# EasyEDA schematic Board for rover motors_2021-02-24.json
TITLE: Rover motors system; REV: 1.0; Date: 2021-02-11; Sheet: 1/1; Drawn By: Vladislav Lozhkin; Company: DOSAAF
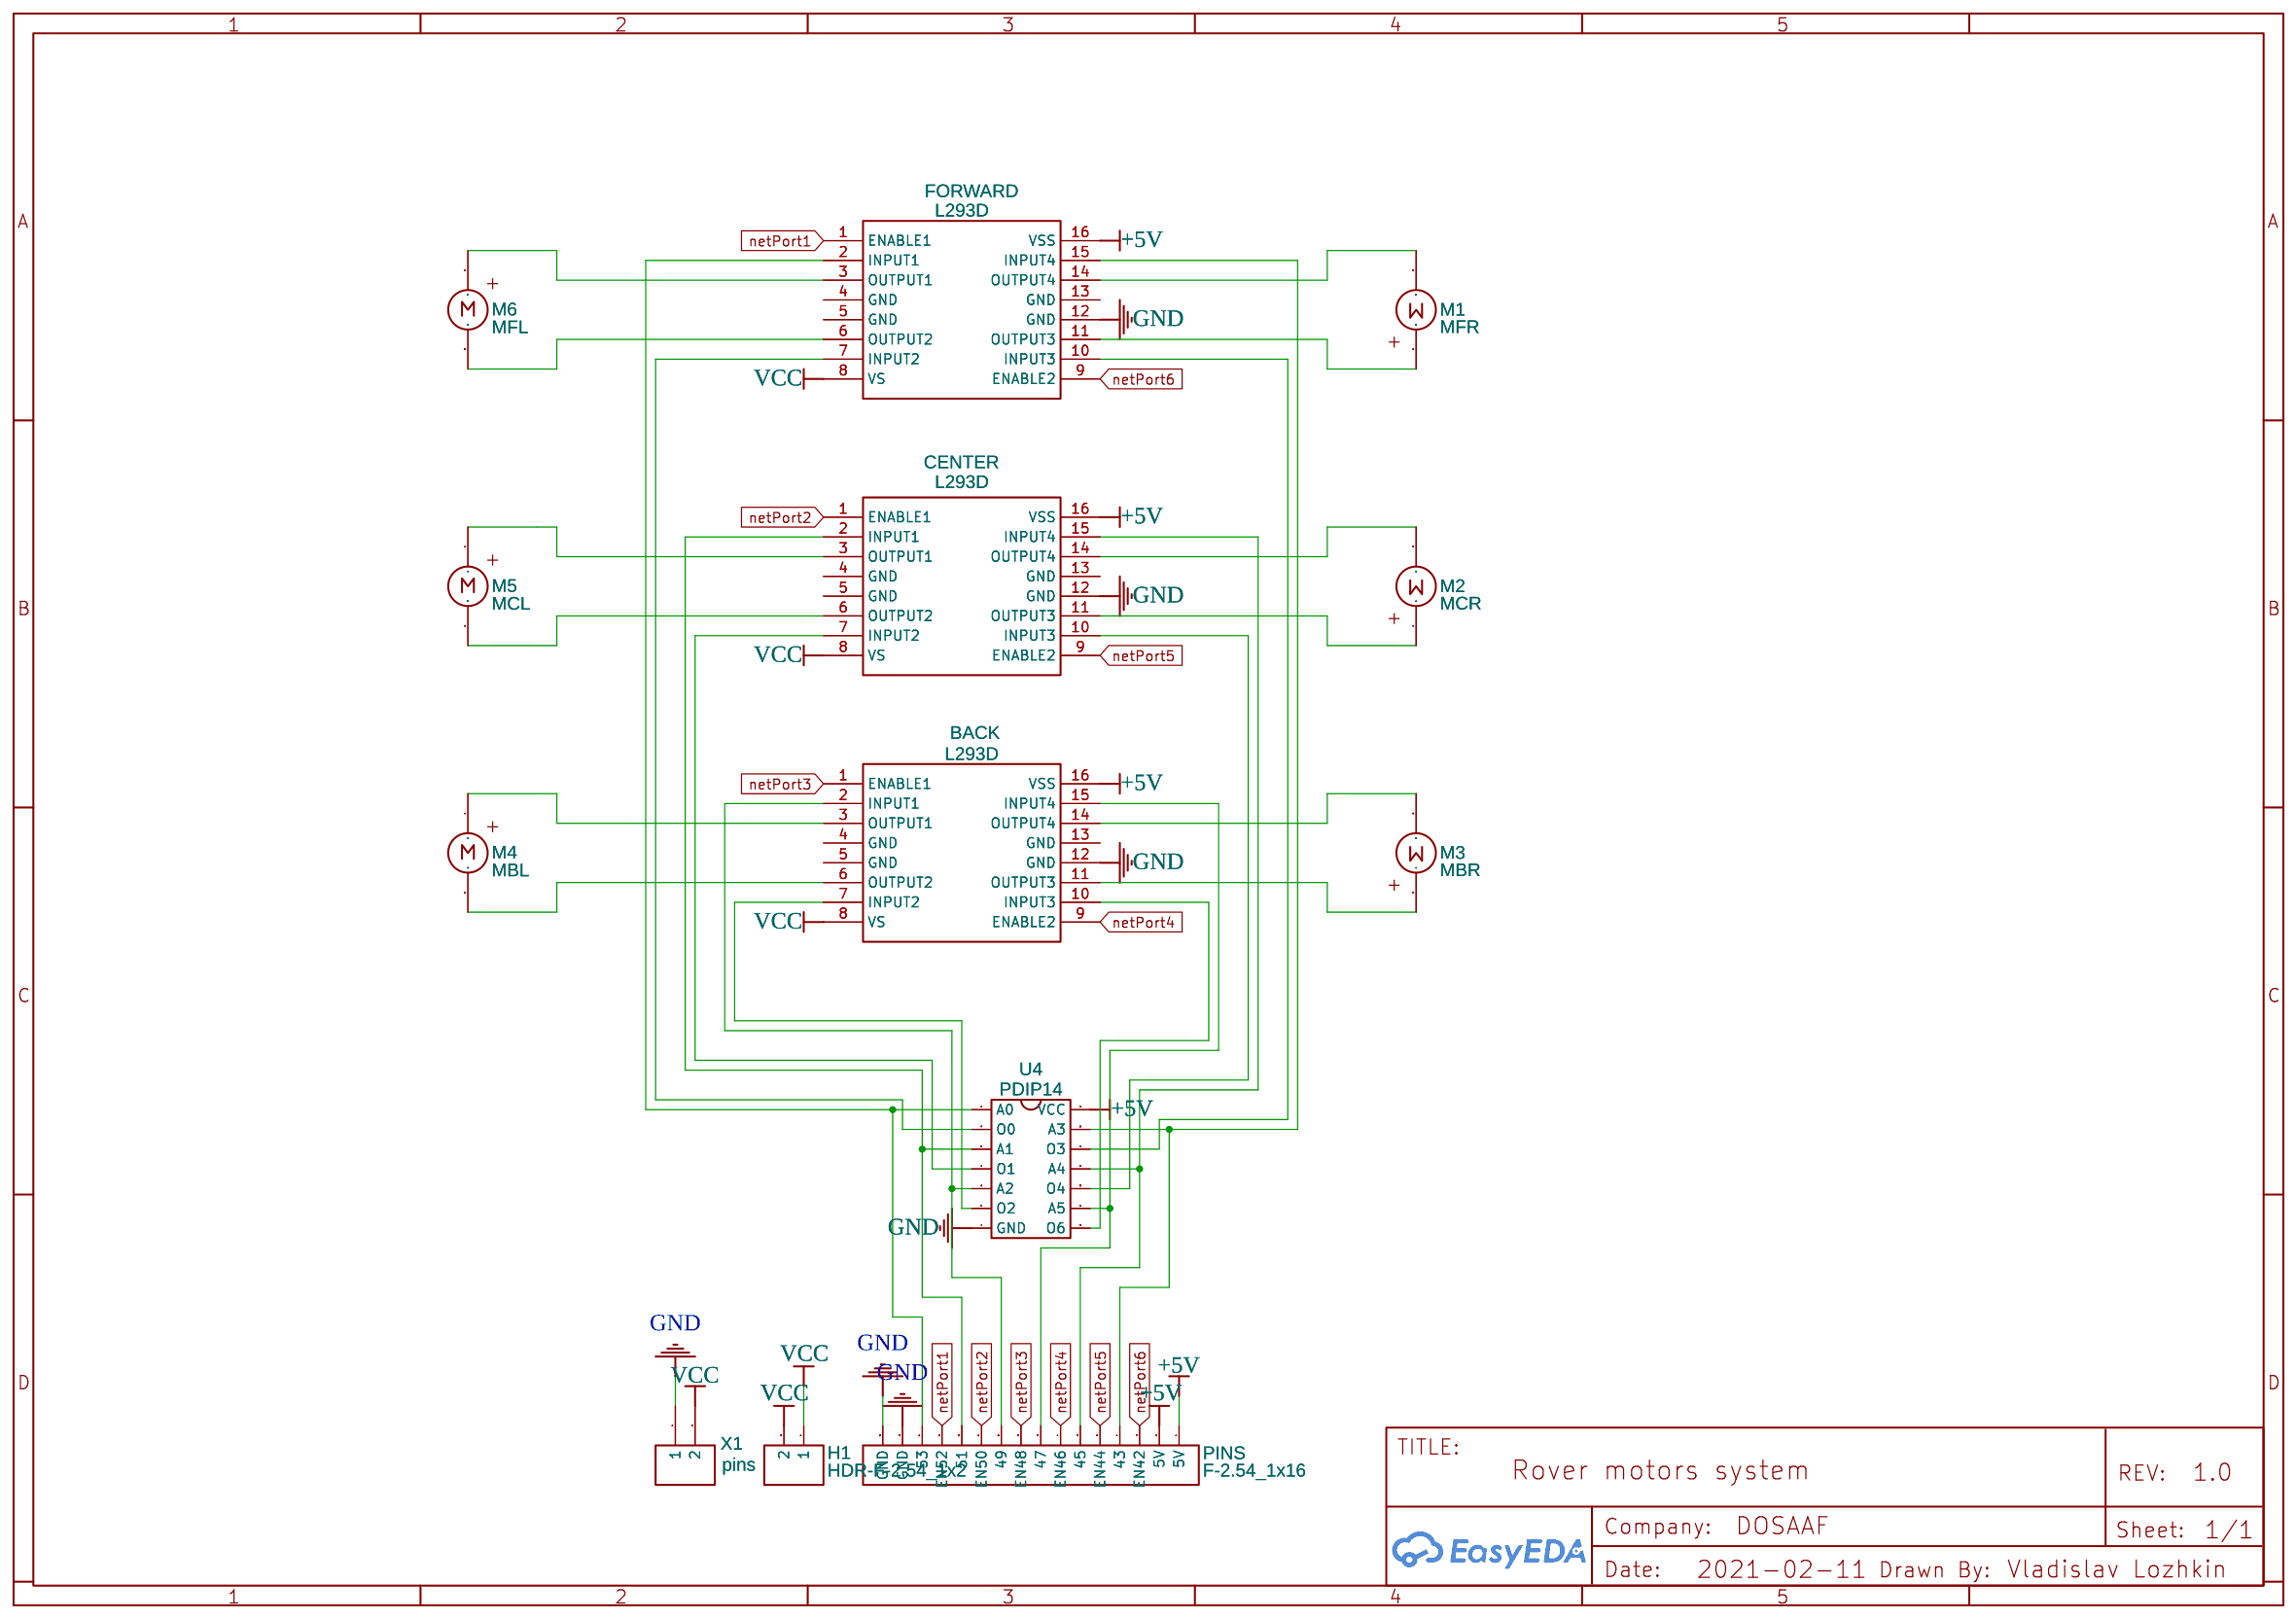
[diagram p0: schematic sheet]

## Parts
BACK  L293D  [DIP-16_L20.0-W6.4-P2.54-LS7.6-BL]
CENTER  L293D  [DIP-16_L20.0-W6.4-P2.54-LS7.6-BL]
FORWARD  L293D  [DIP-16_L20.0-W6.4-P2.54-LS7.6-BL]
H1  HDR-F-2.54_1x2  [HDR-F-2.54_1X2]
M1  MFR  [DIP-1X2P-2.54MM(5.08X5.08)]
M2  MCR  [DIP-1X2P-2.54MM(5.08X5.08)]
M3  MBR  [DIP-1X2P-2.54MM(5.08X5.08)]
M4  MBL  [DIP-1X2P-2.54MM(5.08X5.08)]
M5  MCL  [DIP-1X2P-2.54MM(5.08X5.08)]
M6  MFL  [DIP-1X2P-2.54MM(5.08X5.08)]
PINS  F-2.54_1x16  [HDR-F-2.54_1X16]
U4  PDIP14  [DIP14_TOMI_911]
X1  pins  [KLS2-301-5.00-02P///]

## Library data of the parts
BACK CENTER FORWARD = L293D: Contributor: pitreluc; Supplier: LCSC; Manufacturer: STMicroelectronics; image: //image.lceda.cn/szlcsc/C12340.jpg; Supplier Part: C12340
H1 = HDR-F-2.54_1x2: Supplier Part: C49661; Supplier: LCSC; Contributor: LCEDA_Lib
M1-M6 = MOTOR: Contributor: philip_productions_106
PINS = HDR-F-2.54_1x16: Supplier Part: C66987; Supplier: LCSC; Contributor: LCEDA_Lib
U4 = PDIP14: Contributor: Tomi_911
X1 = клеммник: Contributor: petrychaAA

## Nets
+5V: BACK.16(VSS) CENTER.16(VSS) FORWARD.16(VSS) PINS.1(5V) PINS.2(5V) U4.14(VCC)
GND: BACK.12(GND) CENTER.12(GND) FORWARD.12(GND) PINS.15(GND) PINS.16(GND) U4.7(GND) X1.1
VCC: BACK.8(VS) CENTER.8(VS) FORWARD.8(VS) H1.1 H1.2 X1.2
netPort1: FORWARD.1(ENABLE1) PINS.13(EN52)
netPort2: CENTER.1(ENABLE1) PINS.11(EN50)
netPort3: BACK.1(ENABLE1) PINS.9(EN48)
netPort4: BACK.9(ENABLE2) PINS.7(EN46)
netPort5: CENTER.9(ENABLE2) PINS.5(EN44)
netPort6: FORWARD.9(ENABLE2) PINS.3(EN42)
Net-(BACK-2): BACK.2(INPUT1) PINS.10(49) U4.5(A2)
Net-(BACK-3): BACK.3(OUTPUT1) M4.1
Net-(BACK-6): BACK.6(OUTPUT2) M4.2
Net-(BACK-7): BACK.7(INPUT2) U4.6(O2)
Net-(BACK-10): BACK.10(INPUT3) U4.8(O6)
Net-(BACK-11): BACK.11(OUTPUT3) M3.1
Net-(BACK-14): BACK.14(OUTPUT4) M3.2
Net-(BACK-15): BACK.15(INPUT4) PINS.8(47) U4.9(A5)
Net-(CENTER-2): CENTER.2(INPUT1) PINS.12(51) U4.3(A1)
Net-(CENTER-3): CENTER.3(OUTPUT1) M5.1
Net-(CENTER-6): CENTER.6(OUTPUT2) M5.2
Net-(CENTER-7): CENTER.7(INPUT2) U4.4(O1)
Net-(CENTER-10): CENTER.10(INPUT3) U4.10(O4)
Net-(CENTER-11): CENTER.11(OUTPUT3) M2.1
Net-(CENTER-14): CENTER.14(OUTPUT4) M2.2
Net-(CENTER-15): CENTER.15(INPUT4) PINS.6(45) U4.11(A4)
Net-(FORWARD-2): FORWARD.2(INPUT1) PINS.14(53) U4.1(A0)
Net-(FORWARD-3): FORWARD.3(OUTPUT1) M6.1
Net-(FORWARD-6): FORWARD.6(OUTPUT2) M6.2
Net-(FORWARD-7): FORWARD.7(INPUT2) U4.2(O0)
Net-(FORWARD-10): FORWARD.10(INPUT3) U4.12(O3)
Net-(FORWARD-11): FORWARD.11(OUTPUT3) M1.1
Net-(FORWARD-14): FORWARD.14(OUTPUT4) M1.2
Net-(FORWARD-15): FORWARD.15(INPUT4) PINS.4(43) U4.13(A3)

Not connected (* = marked no-connect by the designer): BACK 4(GND) 5(GND) 13(GND); CENTER 4(GND) 5(GND) 13(GND); FORWARD 4(GND) 5(GND) 13(GND)
